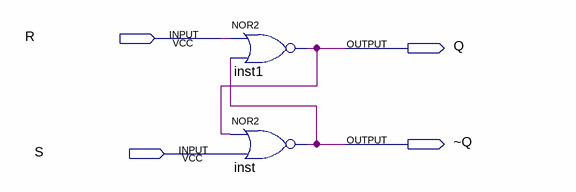
[diagram p0: schematic sheet]
// Quartus schematic SRlatch.bdf as structural Verilog: 2 symbols, 4 pins
module SRlatch (
  input  R,
  input  S,
  output Q,
  output \~Q 
);

  nor inst1 (Q, R, \~Q );
  nor inst (\~Q , Q, S);
endmodule
